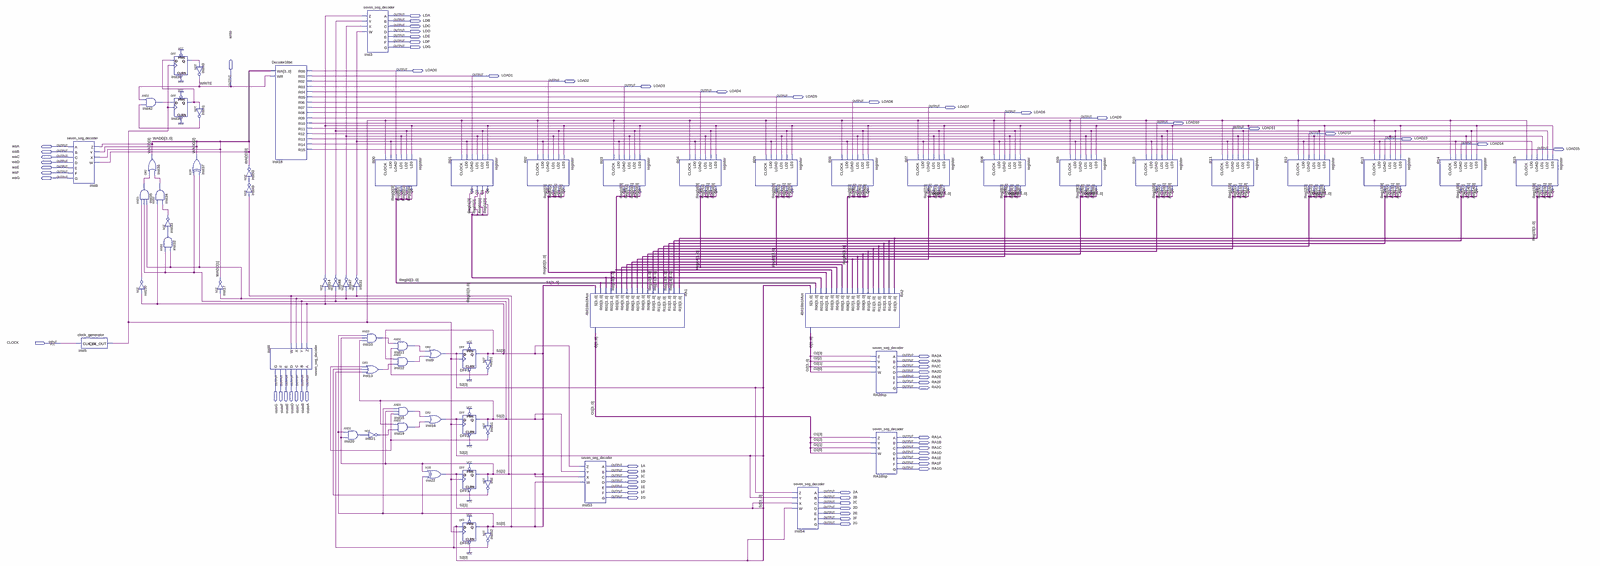
[diagram p0: schematic sheet, whole]
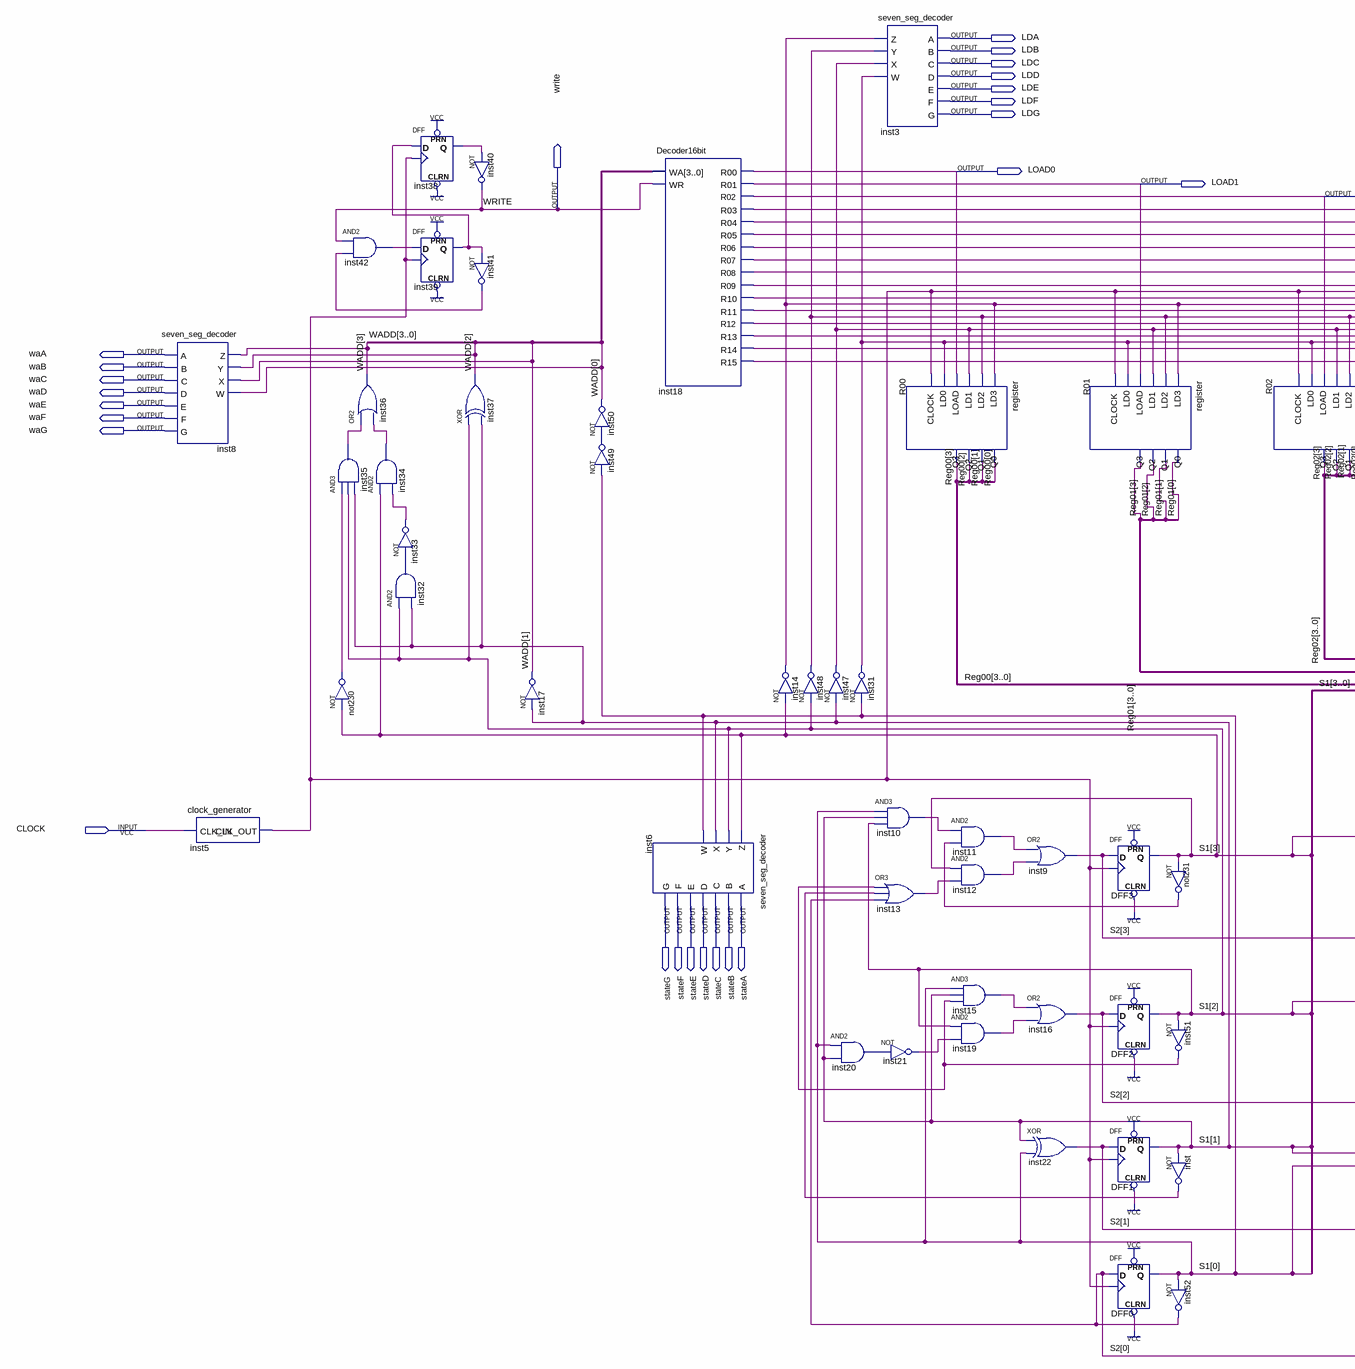
[diagram p1: schematic sheet, left part]
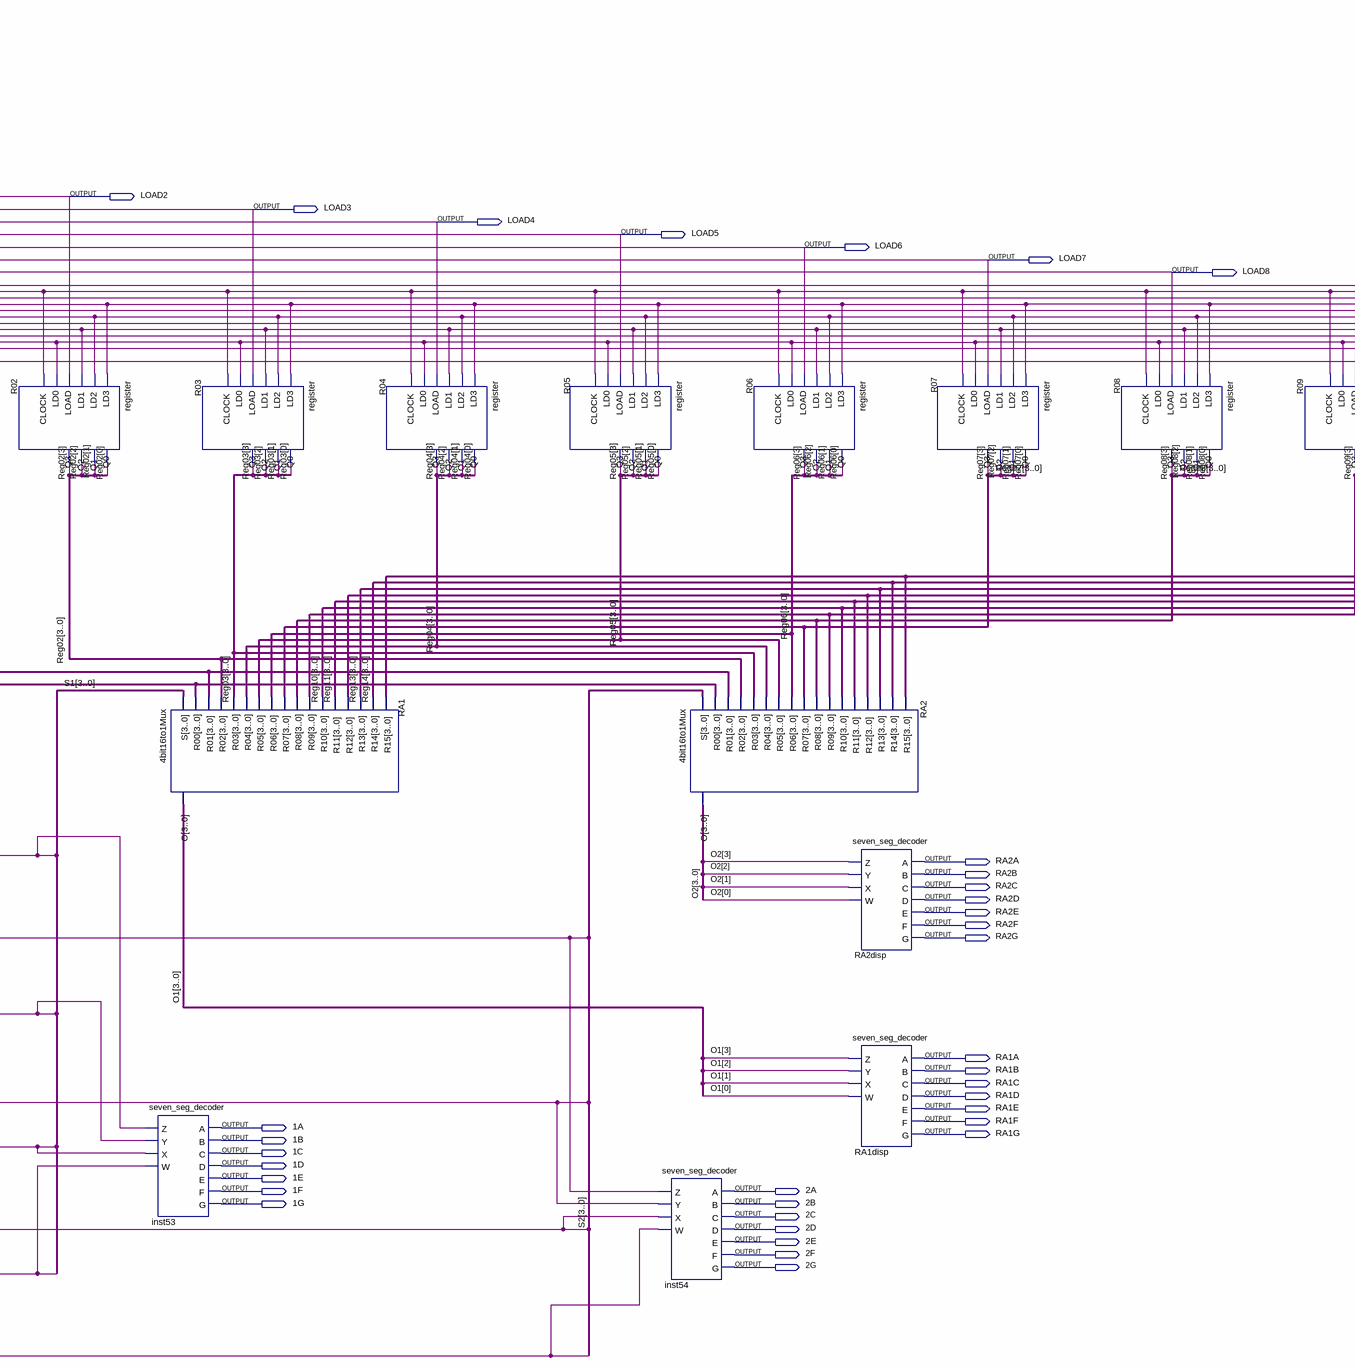
[diagram p2: schematic sheet, centre part]
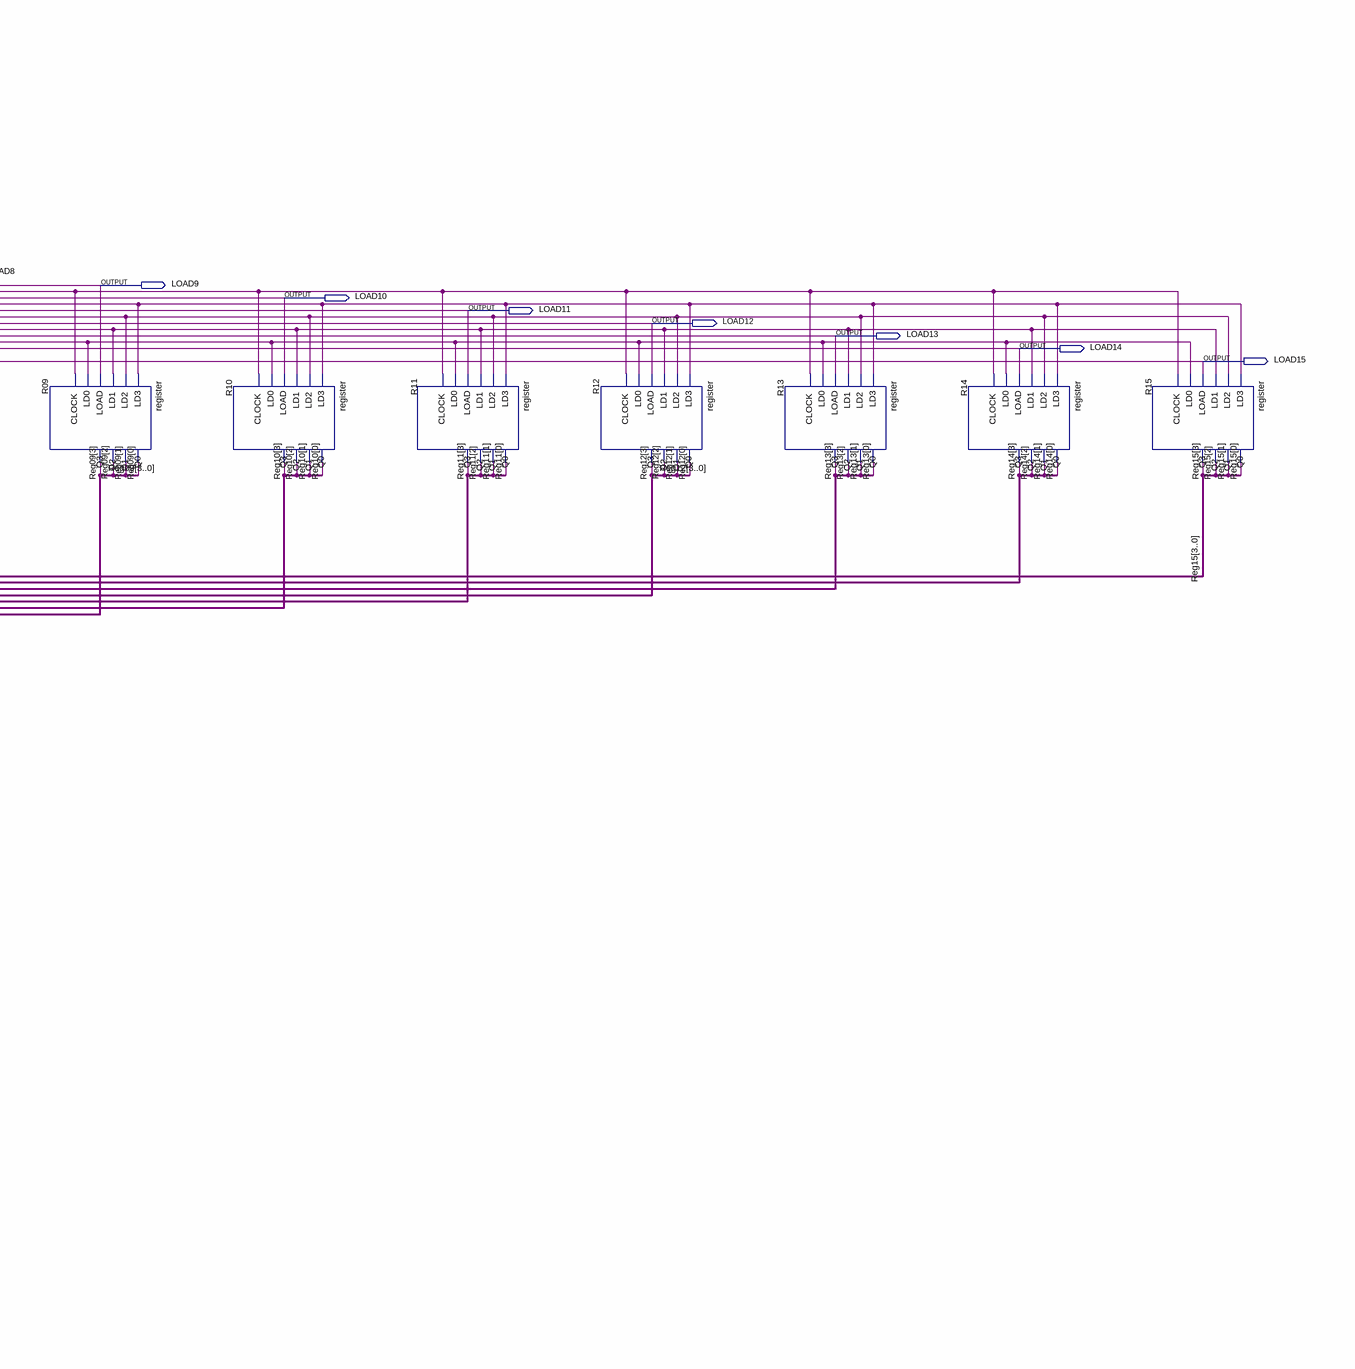
[diagram p3: schematic sheet, right part]
// Quartus schematic RegisterFile.bdf as structural Verilog: 65 symbols, 67 pins
module RegisterFile (
  input  CLOCK,
  output LDA,
  output LDB,
  output LDC,
  output LDD,
  output LDE,
  output LDF,
  output LDG,
  output LOAD0,
  output LOAD1,
  output LOAD2,
  output write,
  output LOAD3,
  output LOAD4,
  output LOAD5,
  output LOAD6,
  output LOAD7,
  output LOAD8,
  output LOAD9,
  output LOAD10,
  output LOAD11,
  output LOAD12,
  output LOAD13,
  output LOAD14,
  output waA,
  output LOAD15,
  output waB,
  output waC,
  output waD,
  output waE,
  output waF,
  output waG,
  output RA2A,
  output RA2B,
  output RA2C,
  output RA2D,
  output stateG,
  output stateF,
  output stateE,
  output stateD,
  output stateC,
  output stateB,
  output stateA,
  output RA2E,
  output RA2F,
  output RA2G,
  output RA1A,
  output RA1B,
  output RA1C,
  output RA1D,
  output RA1E,
  output RA1F,
  output \1A ,
  output RA1G,
  output \1B ,
  output \1C ,
  output \1D ,
  output \1E ,
  output \1F ,
  output \2A ,
  output \1G ,
  output \2B ,
  output \2C ,
  output \2D ,
  output \2E ,
  output \2F ,
  output \2G 
);

  wire inst5_clk_out, inst10_out, inst11_out, inst12_out, inst13_out, inst14_out, inst15_out, inst19_out,
       inst20_out, inst21_out, inst31_out, inst32_out, inst33_out, inst34_out, inst35_out, inst38_q,
       inst39_q, inst41_out, inst42_out, inst47_out, inst48_out, inst49_out, inst51_out, inst_out,
       not230_out, not231_out;
  wire [3:0] O1, O2, Reg00, Reg01, Reg02, Reg03, Reg04, Reg05, Reg06, Reg07, Reg08, Reg09, Reg10, Reg11,
       Reg12, Reg13, Reg14, Reg15, S1, S2, WADD;

  seven_seg_decoder inst8 (
    .Z(WADD[3]), .Y(WADD[2]), .X(WADD[1]), .W(WADD[0]), .A(waA), .B(waB), .C(waC), .D(waD), .E(waE), .F(waF),
    .G(waG));
  clock_generator inst5 (.CLK_IN(CLOCK), .CLK_OUT(inst5_clk_out));
  and inst42 (inst42_out, write, inst41_out);
  or inst36 (WADD[3], inst35_out, inst34_out);
  and inst34 (inst34_out, S1[3], inst33_out);
  and inst35 (inst35_out, not230_out, S1[2], S1[1]);
  not not230 (not230_out, S1[3]);
  DFF inst38 (.CLRN(1'b1), .CLK(inst5_clk_out), .D(inst39_q), .PRN(1'b1), .Q(inst38_q));
  DFF inst39 (.CLRN(1'b1), .CLK(inst5_clk_out), .D(inst42_out), .PRN(1'b1), .Q(inst39_q));
  not inst33 (inst33_out, inst32_out);
  and inst32 (inst32_out, S1[2], S1[1]);
  not inst40 (write, inst38_q);
  not inst41 (inst41_out, inst39_q);
  xor inst37 (WADD[2], S1[2], S1[1]);
  not inst17 (WADD[1], S1[1]);
  not inst50 (WADD[0], inst49_out);
  not inst49 (inst49_out, S1[0]);
  Decoder16bit inst18 (
    .WA(WADD), .WR(write), .R00(LOAD0), .R01(LOAD1), .R02(LOAD2), .R03(LOAD3), .R04(LOAD4), .R05(LOAD5),
    .R06(LOAD6), .R07(LOAD7), .R08(LOAD8), .R09(LOAD9), .R10(LOAD10), .R11(LOAD11), .R12(LOAD12),
    .R13(LOAD13), .R14(LOAD14), .R15(LOAD15));
  seven_seg_decoder inst6 (
    .Z(S1[3]), .Y(S1[2]), .X(S1[1]), .W(S1[0]), .A(stateA), .B(stateB), .C(stateC), .D(stateD), .E(stateE),
    .F(stateF), .G(stateG));
  not inst14 (inst14_out, S1[3]);
  not inst47 (inst47_out, S1[1]);
  not inst48 (inst48_out, S1[2]);
  seven_seg_decoder inst3 (
    .Z(inst14_out), .Y(inst48_out), .X(inst47_out), .W(inst31_out), .A(LDA), .B(LDB), .C(LDC), .D(LDD),
    .E(LDE), .F(LDF), .G(LDG));
  not inst31 (inst31_out, S1[0]);
  and inst10 (inst10_out, S1[0], S1[1], S1[2]);
  or inst13 (inst13_out, inst51_out, inst_out, S2[0]);
  and inst20 (inst20_out, S1[0], S1[1]);
  register R00 (
    .LD3(inst14_out), .LD2(inst48_out), .LD1(inst47_out), .LOAD(LOAD0), .LD0(inst31_out),
    .CLOCK(inst5_clk_out), .Q0(Reg00[0]), .Q1(Reg00[1]), .Q2(Reg00[2]), .Q3(Reg00[3]));
  not inst21 (inst21_out, inst20_out);
  and inst11 (inst11_out, inst10_out, not231_out);
  and inst12 (inst12_out, S1[3], inst13_out);
  and inst15 (inst15_out, S1[0], S1[1], inst51_out);
  and inst19 (inst19_out, S1[2], inst21_out);
  or inst9 (S2[3], inst11_out, inst12_out);
  or inst16 (S2[2], inst15_out, inst19_out);
  xor inst22 (S2[1], S1[1], S1[0]);
  register R01 (
    .LD3(inst14_out), .LD2(inst48_out), .LD1(inst47_out), .LOAD(LOAD1), .LD0(inst31_out),
    .CLOCK(inst5_clk_out), .Q0(Reg01[0]), .Q1(Reg01[1]), .Q2(Reg01[2]), .Q3(Reg01[3]));
  DFF DFF3 (.CLRN(1'b1), .CLK(inst5_clk_out), .D(S2[3]), .PRN(1'b1), .Q(S1[3]));
  DFF DFF2 (.CLRN(1'b1), .CLK(inst5_clk_out), .D(S2[2]), .PRN(1'b1), .Q(S1[2]));
  DFF DFF1 (.CLRN(1'b1), .CLK(inst5_clk_out), .D(S2[1]), .PRN(1'b1), .Q(S1[1]));
  DFF DFF0 (.CLRN(1'b1), .CLK(inst5_clk_out), .D(S2[0]), .PRN(1'b1), .Q(S1[0]));
  not not231 (not231_out, S1[3]);
  not inst51 (inst51_out, S1[2]);
  not inst (inst_out, S1[1]);
  not inst52 (S2[0], S1[0]);
  register R02 (
    .LD3(inst14_out), .LD2(inst48_out), .LD1(inst47_out), .LOAD(LOAD2), .LD0(inst31_out),
    .CLOCK(inst5_clk_out), .Q0(Reg02[0]), .Q1(Reg02[1]), .Q2(Reg02[2]), .Q3(Reg02[3]));
  \4bit16to1Mux  RA1 (
    .S(S1), .R00(Reg00), .R01(Reg01), .R02(Reg02), .R03(Reg03), .R04(Reg04), .R05(Reg05), .R06(Reg06),
    .R07(Reg07), .R08(Reg08), .R09(Reg09), .R10(Reg10), .R11(Reg11), .R12(Reg12), .R13(Reg13), .R14(Reg14),
    .R15(Reg15), .O(O1));
  seven_seg_decoder inst53 (
    .Z(S1[3]), .Y(S1[2]), .X(S1[1]), .W(S1[0]), .A(\1A ), .B(\1B ), .C(\1C ), .D(\1D ), .E(\1E ), .F(\1F ),
    .G(\1G ));
  register R03 (
    .LD3(inst14_out), .LD2(inst48_out), .LD1(inst47_out), .LOAD(LOAD3), .LD0(inst31_out),
    .CLOCK(inst5_clk_out), .Q0(Reg03[0]), .Q1(Reg03[1]), .Q2(Reg03[2]), .Q3(Reg03[3]));
  register R04 (
    .LD3(inst14_out), .LD2(inst48_out), .LD1(inst47_out), .LOAD(LOAD4), .LD0(inst31_out),
    .CLOCK(inst5_clk_out), .Q0(Reg04[0]), .Q1(Reg04[1]), .Q2(Reg04[2]), .Q3(Reg04[3]));
  register R05 (
    .LD3(inst14_out), .LD2(inst48_out), .LD1(inst47_out), .LOAD(LOAD5), .LD0(inst31_out),
    .CLOCK(inst5_clk_out), .Q0(Reg05[0]), .Q1(Reg05[1]), .Q2(Reg05[2]), .Q3(Reg05[3]));
  \4bit16to1Mux  RA2 (
    .S(S2), .R00(Reg00), .R01(Reg01), .R02(Reg02), .R03(Reg03), .R04(Reg04), .R05(Reg05), .R06(Reg06),
    .R07(Reg07), .R08(Reg08), .R09(Reg09), .R10(Reg10), .R11(Reg11), .R12(Reg12), .R13(Reg13), .R14(Reg14),
    .R15(Reg15), .O(O2));
  seven_seg_decoder inst54 (
    .Z(S2[3]), .Y(S2[2]), .X(S2[1]), .W(S2[0]), .A(\2A ), .B(\2B ), .C(\2C ), .D(\2D ), .E(\2E ), .F(\2F ),
    .G(\2G ));
  register R06 (
    .LD3(inst14_out), .LD2(inst48_out), .LD1(inst47_out), .LOAD(LOAD6), .LD0(inst31_out),
    .CLOCK(inst5_clk_out), .Q0(Reg06[0]), .Q1(Reg06[1]), .Q2(Reg06[2]), .Q3(Reg06[3]));
  seven_seg_decoder RA2disp (
    .Z(O2[3]), .Y(O2[2]), .X(O2[1]), .W(O2[0]), .A(RA2A), .B(RA2B), .C(RA2C), .D(RA2D), .E(RA2E), .F(RA2F),
    .G(RA2G));
  seven_seg_decoder RA1disp (
    .Z(O1[3]), .Y(O1[2]), .X(O1[1]), .W(O1[0]), .A(RA1A), .B(RA1B), .C(RA1C), .D(RA1D), .E(RA1E), .F(RA1F),
    .G(RA1G));
  register R07 (
    .LD3(inst14_out), .LD2(inst48_out), .LD1(inst47_out), .LOAD(LOAD7), .LD0(inst31_out),
    .CLOCK(inst5_clk_out), .Q0(Reg07[0]), .Q1(Reg07[1]), .Q2(Reg07[2]), .Q3(Reg07[3]));
  register R08 (
    .LD3(inst14_out), .LD2(inst48_out), .LD1(inst47_out), .LOAD(LOAD8), .LD0(inst31_out),
    .CLOCK(inst5_clk_out), .Q0(Reg08[0]), .Q1(Reg08[1]), .Q2(Reg08[2]), .Q3(Reg08[3]));
  register R09 (
    .LD3(inst14_out), .LD2(inst48_out), .LD1(inst47_out), .LOAD(LOAD9), .LD0(inst31_out),
    .CLOCK(inst5_clk_out), .Q0(Reg09[0]), .Q1(Reg09[1]), .Q2(Reg09[2]), .Q3(Reg09[3]));
  register R10 (
    .LD3(inst14_out), .LD2(inst48_out), .LD1(inst47_out), .LOAD(LOAD10), .LD0(inst31_out),
    .CLOCK(inst5_clk_out), .Q0(Reg10[0]), .Q1(Reg10[1]), .Q2(Reg10[2]), .Q3(Reg10[3]));
  register R11 (
    .LD3(inst14_out), .LD2(inst48_out), .LD1(inst47_out), .LOAD(LOAD11), .LD0(inst31_out),
    .CLOCK(inst5_clk_out), .Q0(Reg11[0]), .Q1(Reg11[1]), .Q2(Reg11[2]), .Q3(Reg11[3]));
  register R12 (
    .LD3(inst14_out), .LD2(inst48_out), .LD1(inst47_out), .LOAD(LOAD12), .LD0(inst31_out),
    .CLOCK(inst5_clk_out), .Q0(Reg12[0]), .Q1(Reg12[1]), .Q2(Reg12[2]), .Q3(Reg12[3]));
  register R13 (
    .LD3(inst14_out), .LD2(inst48_out), .LD1(inst47_out), .LOAD(LOAD13), .LD0(inst31_out),
    .CLOCK(inst5_clk_out), .Q0(Reg13[0]), .Q1(Reg13[1]), .Q2(Reg13[2]), .Q3(Reg13[3]));
  register R14 (
    .LD3(inst14_out), .LD2(inst48_out), .LD1(inst47_out), .LOAD(LOAD14), .LD0(inst31_out),
    .CLOCK(inst5_clk_out), .Q0(Reg14[0]), .Q1(Reg14[1]), .Q2(Reg14[2]), .Q3(Reg14[3]));
  register R15 (
    .LD3(inst14_out), .LD2(inst48_out), .LD1(inst47_out), .LOAD(LOAD15), .LD0(inst31_out),
    .CLOCK(inst5_clk_out), .Q0(Reg15[0]), .Q1(Reg15[1]), .Q2(Reg15[2]), .Q3(Reg15[3]));
endmodule
